# Altium project SDR_LAPAC.PrjPcb (part 3 of 4)

## Sheet Power.SchDoc
size D; DocumentNumber: 2; SheetNumber: 2
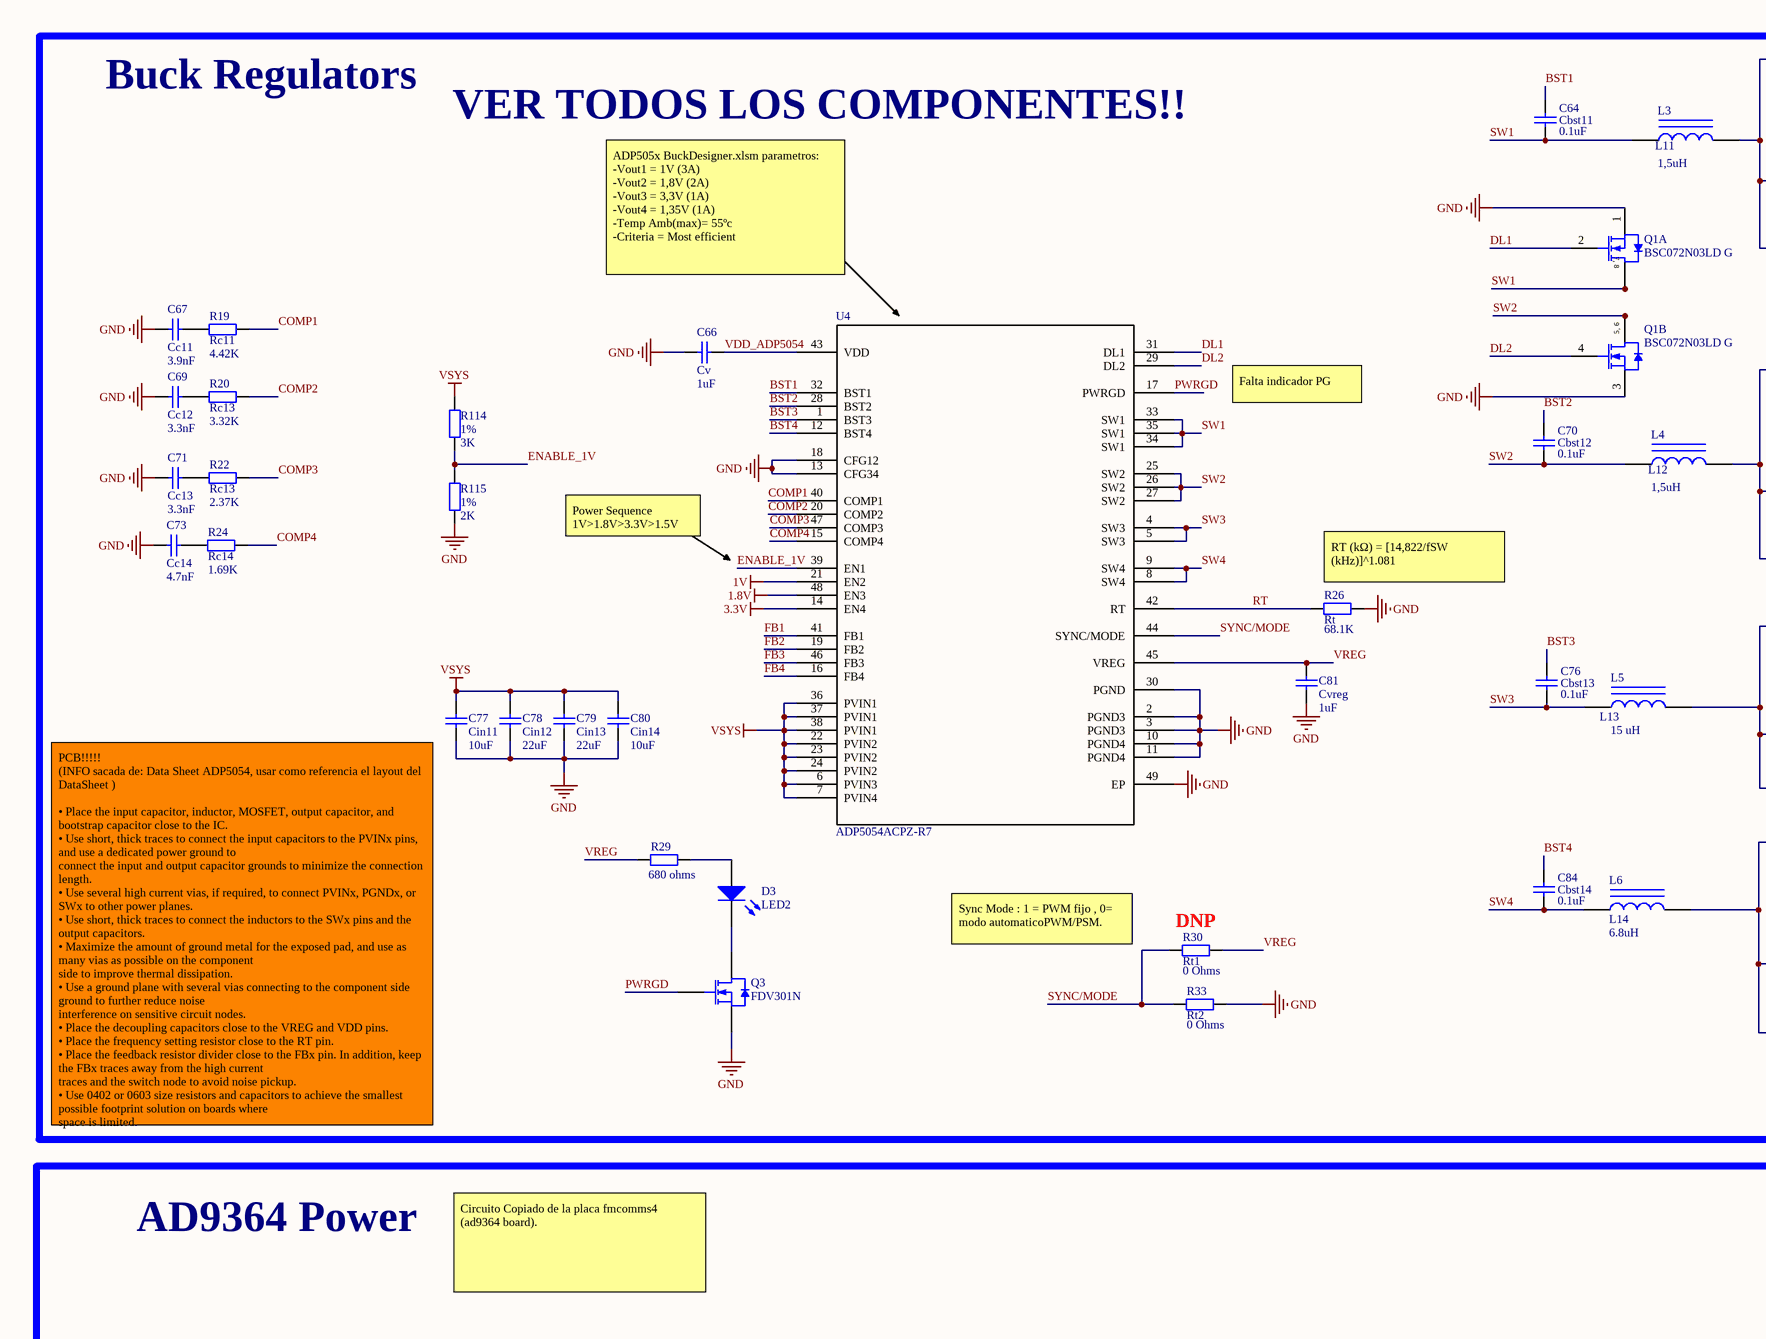
[diagram p14: Power.SchDoc, top left]
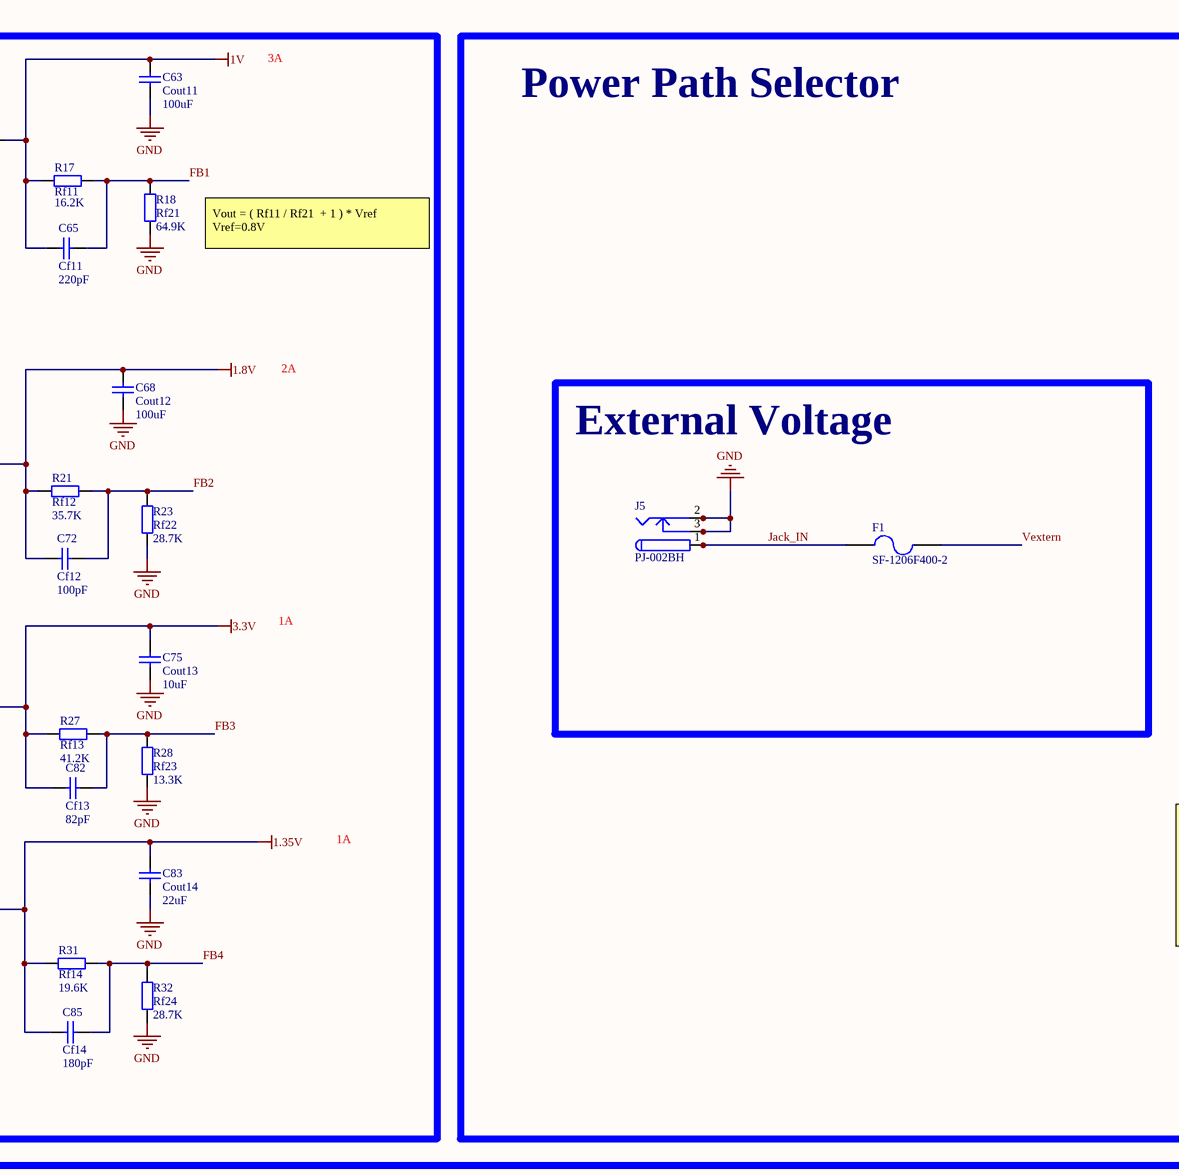
[diagram p15: Power.SchDoc, top middle]
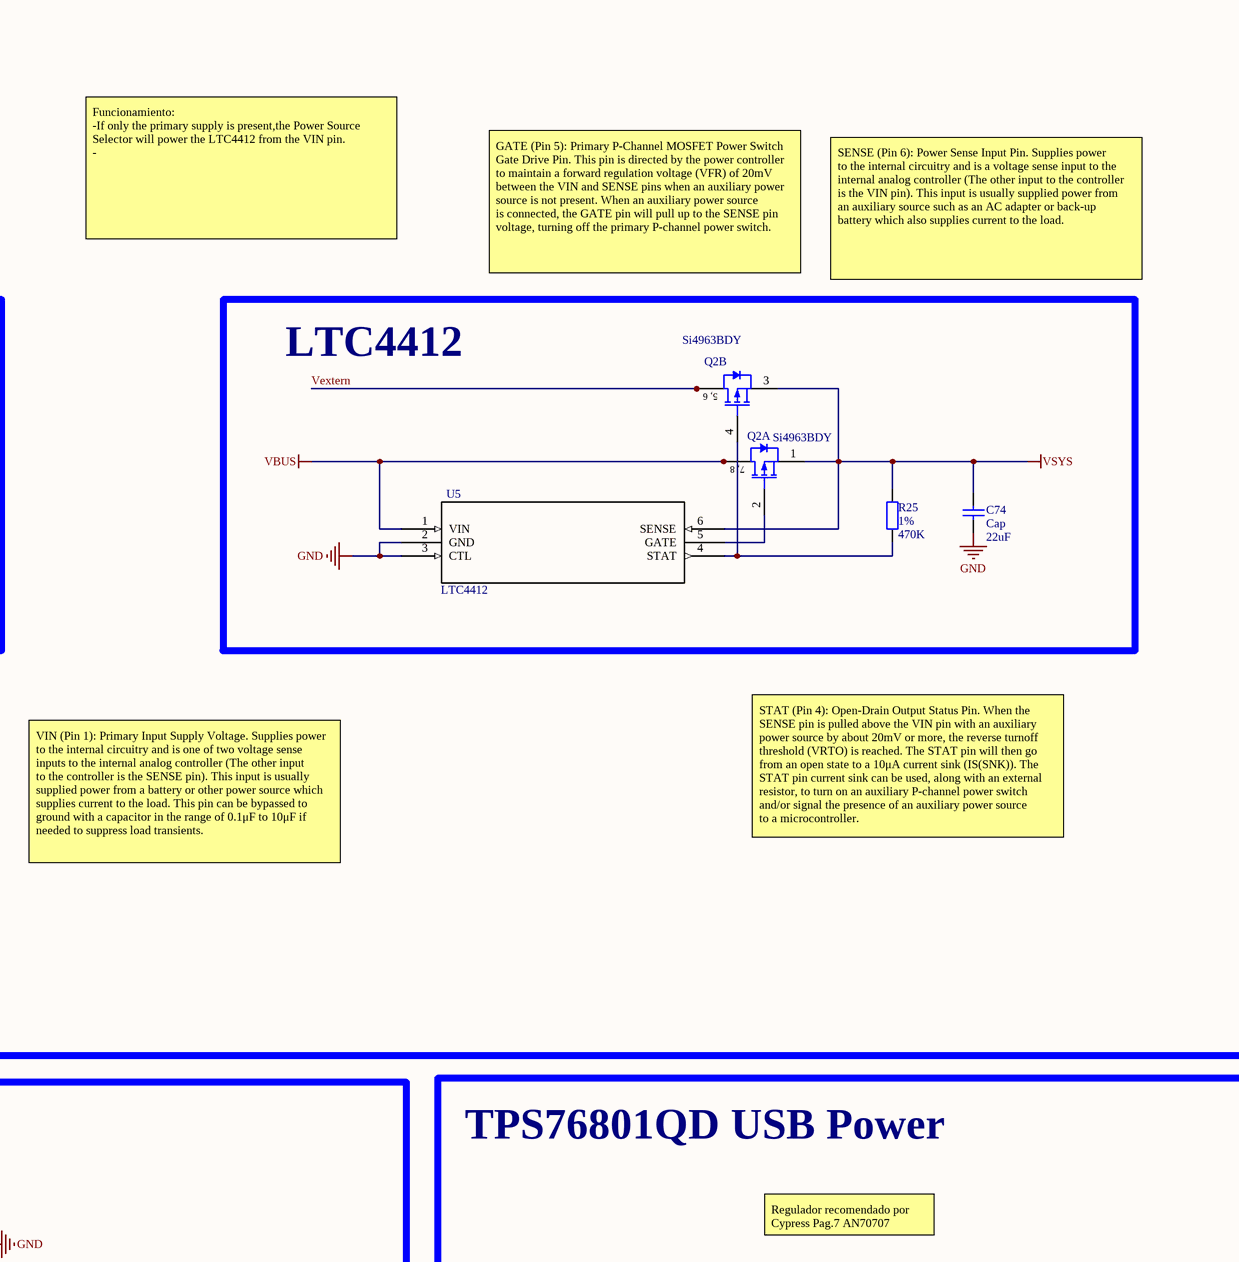
[diagram p16: Power.SchDoc, top right]
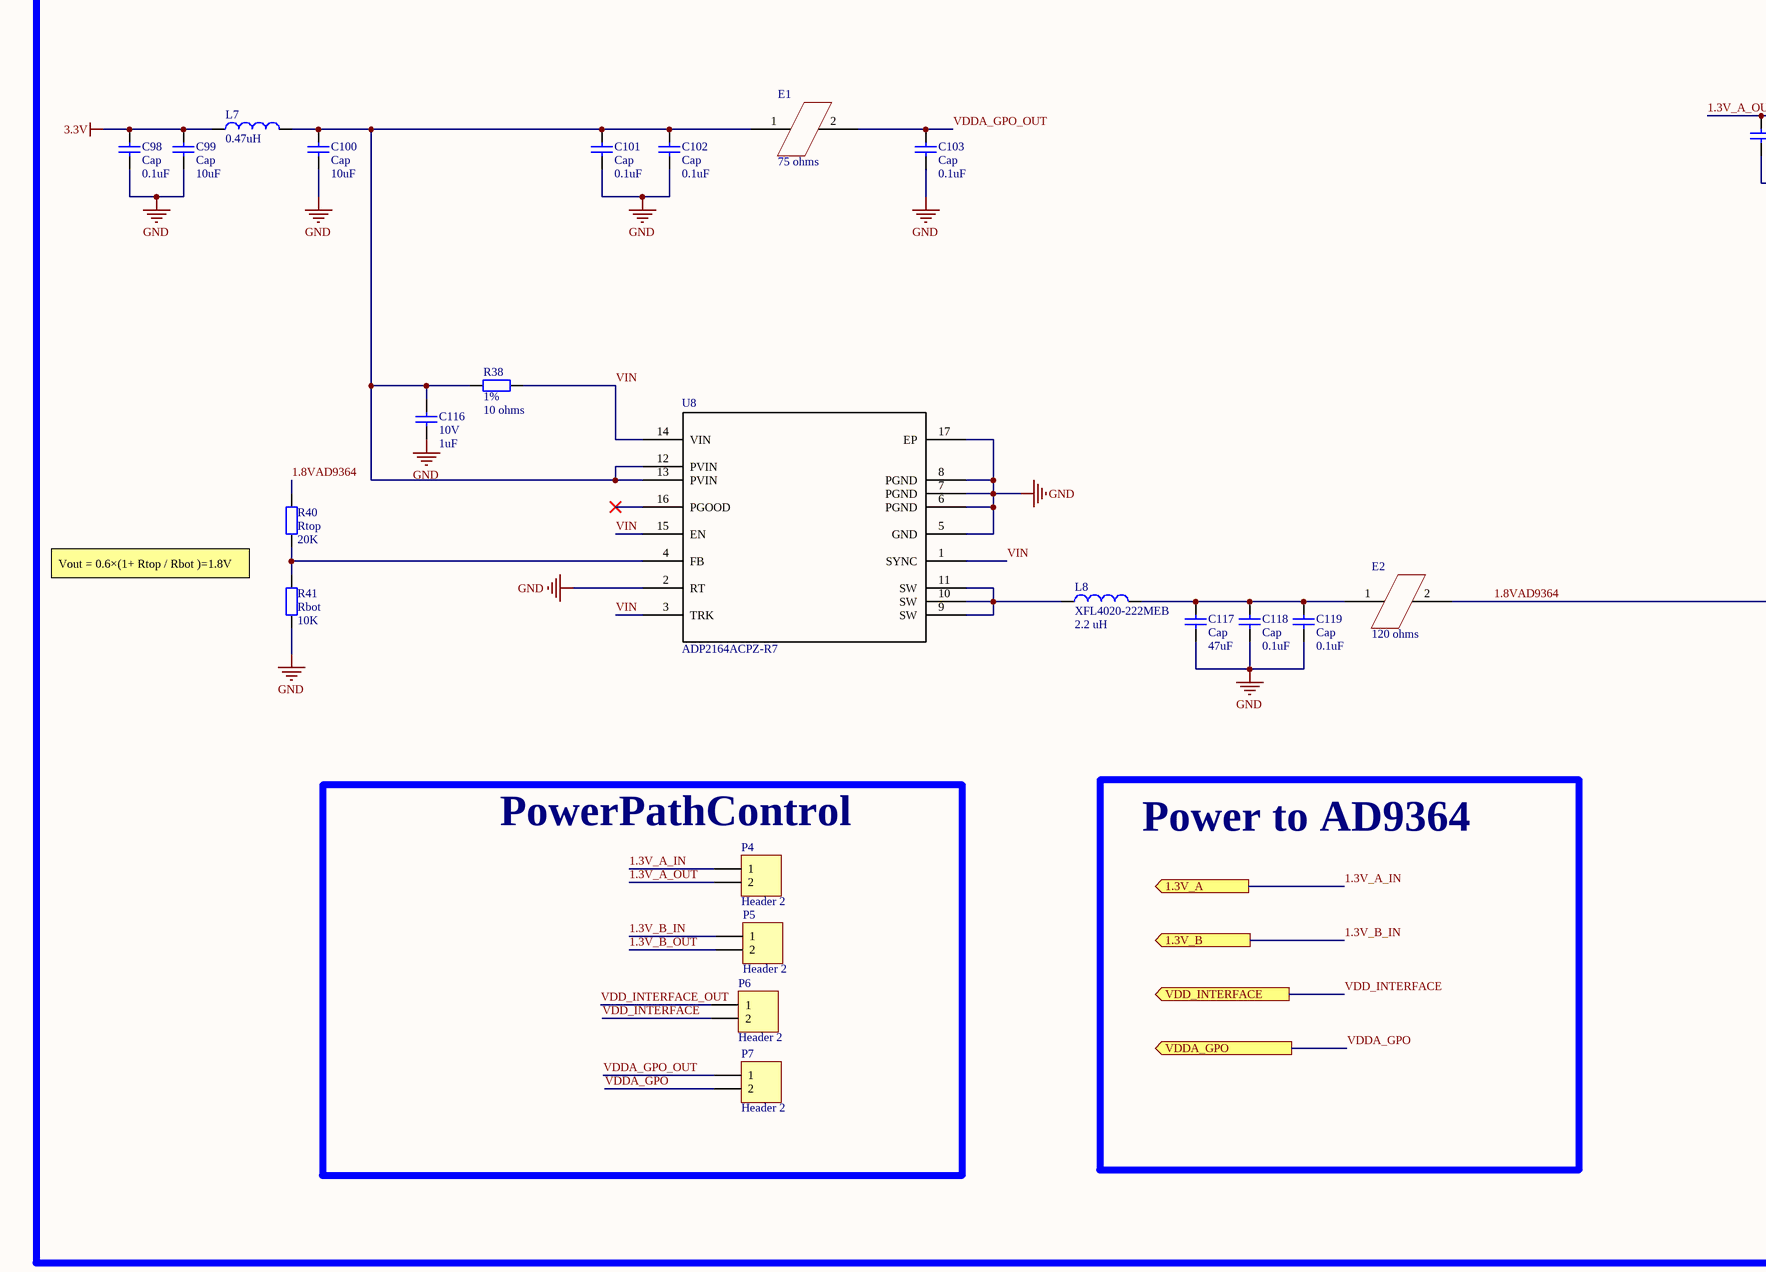
[diagram p17: Power.SchDoc, bottom left]
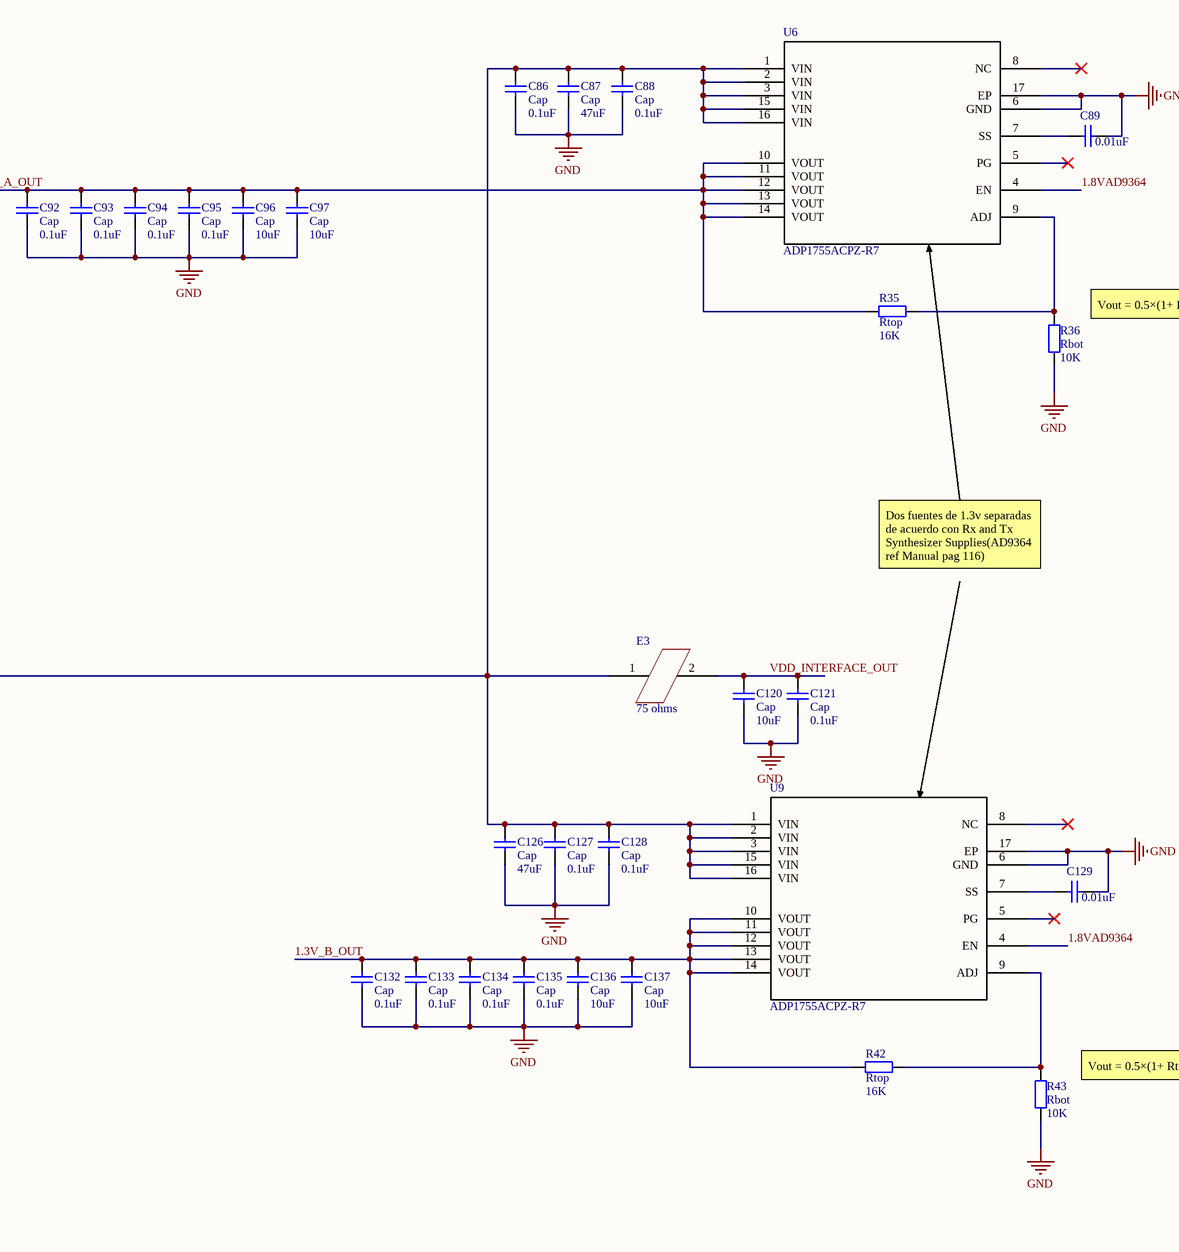
[diagram p18: Power.SchDoc, bottom middle]
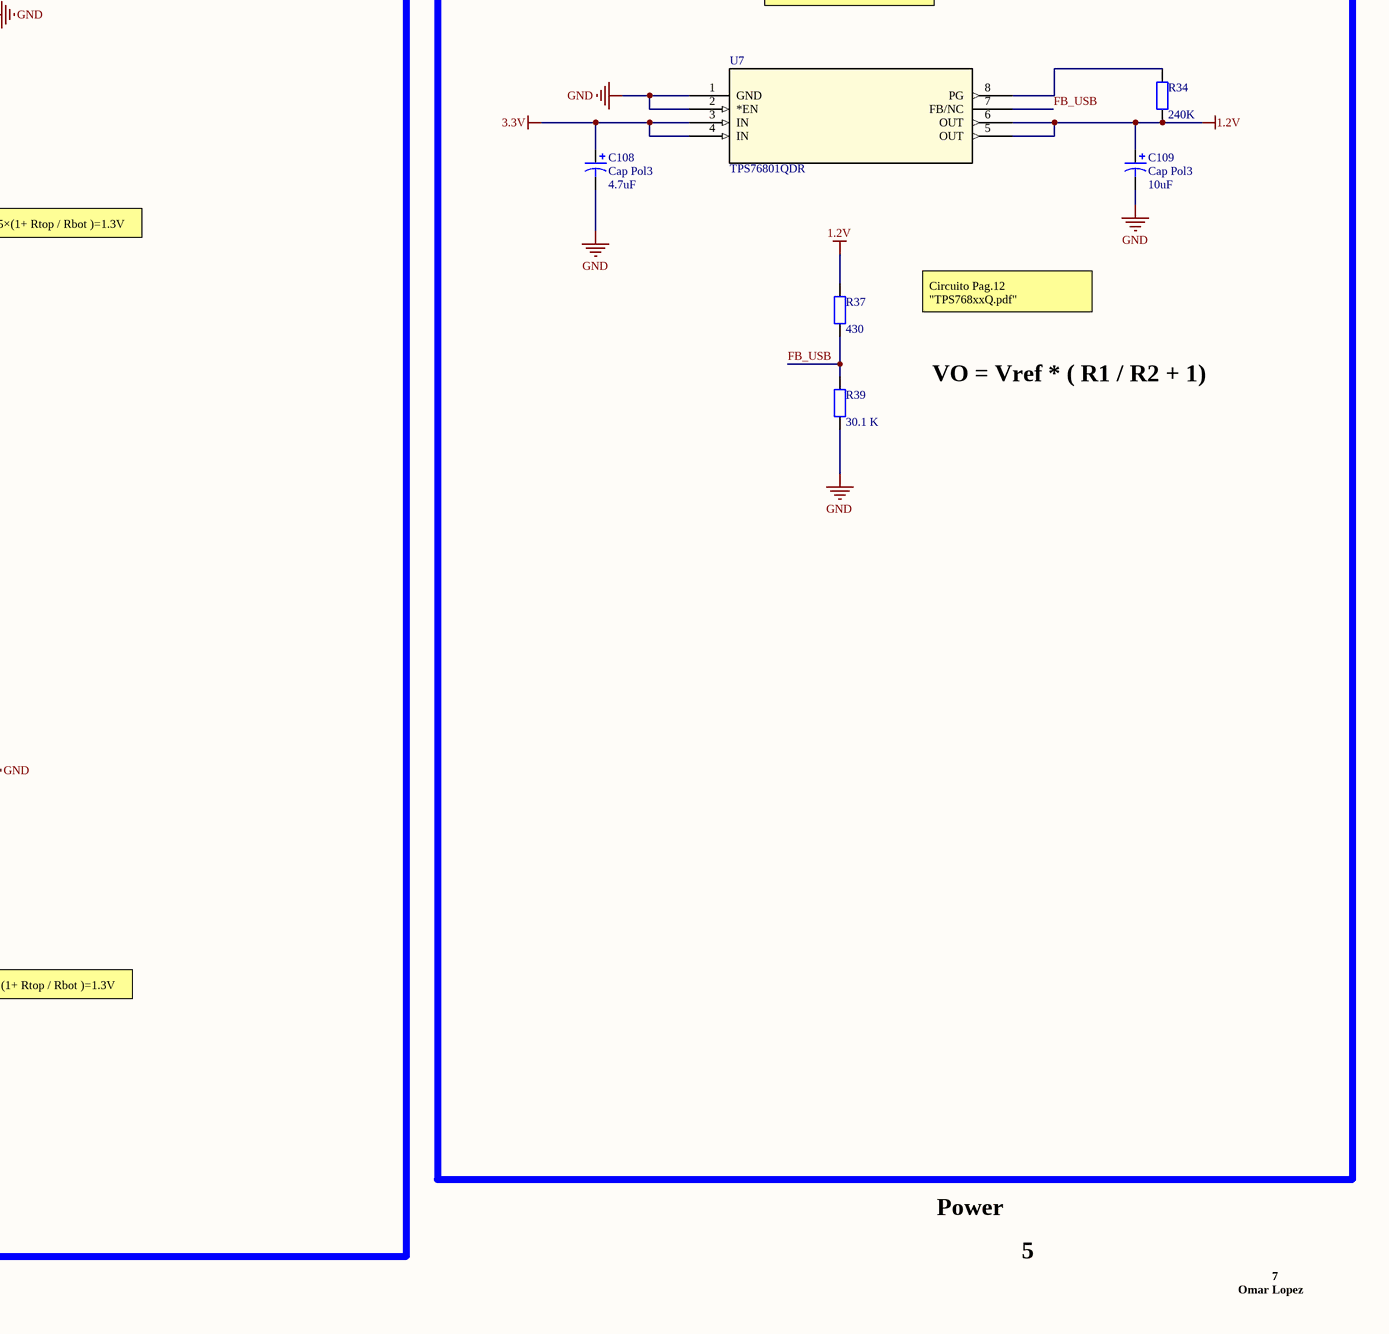
[diagram p19: Power.SchDoc, bottom right]

### Parts
C63  Cout11  value 100uF  [GRM1206MurataCap]
C64  Cbst11  value 0.1uF  [GRM0402MurataCap]
C65  Cf11  value 220pF  [GRM0402MurataCap]
C66  Cv  value 1uF  [GRM0402MurataCap]
C67  Cc11  value 3.9nF  [GRM0402MurataCap]
C68  Cout12  value 100uF  [GRM1206MurataCap]
C69  Cc12  value 3.3nF  [GRM0402MurataCap]
C70  Cbst12  value 0.1uF  [GRM0402MurataCap]
C71  Cc13  value 3.3nF  [GRM0402MurataCap]
C72  Cf12  value 100pF  [GRM0402MurataCap]
C73  Cc14  value 4.7nF  [GRM0402MurataCap]
C74  Cap  value 22uF  [GRM1210MurataCap]
C75  Cout13  value 10uF  [GRM1206MurataCap]
C76  Cbst13  value 0.1uF  [GRM0402MurataCap]
C77  Cin11  value 10uF  [GRM1210MurataCap]
C78  Cin12  value 22uF  [GRM1210MurataCap]
C79  Cin13  value 22uF  [GRM1210MurataCap]
C80  Cin14  value 10uF  [GRM1210MurataCap]
C81  Cvreg  value 1uF  [GRM0402MurataCap]
C82  Cf13  value 82pF  [GRM0402MurataCap]
C83  Cout14  value 22uF  [GRM1206MurataCap]
C84  Cbst14  value 0.1uF  [GRM0402MurataCap]
C85  Cf14  value 180pF  [GRM0402MurataCap]
C86  Cap  value 0.1uF  [GRM0402MurataCap]
C87  Cap  value 47uF  [GRM0805MurataCap]
C88  Cap  value 0.1uF  [GRM0402MurataCap]
C89  value 0.01uF  [GRM0402MurataCap]  (hidden comment: Cap)
C92  Cap  value 0.1uF  [GRM0402MurataCap]
C93  Cap  value 0.1uF  [GRM0402MurataCap]
C94  Cap  value 0.1uF  [GRM0402MurataCap]
C95  Cap  value 0.1uF  [GRM0402MurataCap]
C96  Cap  value 10uF  [GRM0603MurataCap]
C97  Cap  value 10uF  [GRM0603MurataCap]
C98  Cap  value 0.1uF  [GRM0402MurataCap]
C99  Cap  value 10uF  [GRM0603MurataCap]
C100  Cap  value 10uF  [GRM0603MurataCap]
C101  Cap  value 0.1uF  [GRM0402MurataCap]
C102  Cap  value 0.1uF  [GRM0402MurataCap]
C103  Cap  value 0.1uF  [GRM0402MurataCap]
C108  Cap Pol3  value 4.7uF  [CapTalCaseM]
C109  Cap Pol3  value 10uF  [TAJ_DorE2917]
C116  10V  value 1uF  [GRM0402MurataCap]
C117  Cap  value 47uF  [GRM0805MurataCap]
C118  Cap  value 0.1uF  [GRM0402MurataCap]
C119  Cap  value 0.1uF  [GRM0402MurataCap]
C120  Cap  value 10uF  [GRM0603MurataCap]
C121  Cap  value 0.1uF  [GRM0402MurataCap]
C126  Cap  value 47uF  [GRM0805MurataCap]
C127  Cap  value 0.1uF  [GRM0402MurataCap]
C128  Cap  value 0.1uF  [GRM0402MurataCap]
C129  value 0.01uF  [GRM0402MurataCap]  (hidden comment: Cap)
C132  Cap  value 0.1uF  [GRM0402MurataCap]
C133  Cap  value 0.1uF  [GRM0402MurataCap]
C134  Cap  value 0.1uF  [GRM0402MurataCap]
C135  Cap  value 0.1uF  [GRM0402MurataCap]
C136  Cap  value 10uF  [GRM0603MurataCap]
C137  Cap  value 10uF  [GRM0603MurataCap]
D3  LED2  [LTSTC191]
E1  75 ohms  [BLM15BA750SN1D]
E2  120 ohms  [BLM15BA750SN1D]
E3  75 ohms  [BLM15BA750SN1D]
F1  SF-1206F400-2  [SF-1206F400-2]
J5  PJ-002BH  [PJ-002BH]
L3  L11  value 1,5uH  [XAL4040-152]
L4  L12  value 1,5uH  [XAL4040-152]
L5  L13  value 15 uH  [XAL5050-153]
L6  L14  value 6.8uH  [XAL8080-682]
L7  0.47uH  [LQH32PNR47NN0L]
L8  XFL4020-222MEB  value 2.2 uH  [XFL4020 SERIES]
P4  Header 2  [Header2x1]
P5  Header 2  [Header2x1]
P6  Header 2  [Header2x1]
P7  Header 2  [Header2x1]
Q1  BSC072N03LD G  [INF-PG-TDSON-8-4_V]  (parts A,B of 2)
Q2  Si4963BDY  [SO-8_N]  (parts A,B of 2)
Q3  FDV301N  [SOT-23B]
R17  Rf11  value 16.2K  [RC0402N]
R18  Rf21  value 64.9K  [RC0402N]
R19  Rc11  value 4.42K  [RC0402N]
R20  Rc13  value 3.32K  [RC0402N]
R21  Rf12  value 35.7K  [RC0402N]
R22  Rc13  value 2.37K  [RC0402N]
R23  Rf22  value 28.7K  [RC0402N]
R24  Rc14  value 1.69K  [RC0402N]
R25  1%  value 470K  [RC0402N]
R26  Rt  value 68.1K  [RC0402N]
R27  Rf13  value 41.2K  [RC0402N]
R28  Rf23  value 13.3K  [RC0402N]
R29  value 680 ohms  [RC0402N]
R30  Rt1  value 0 Ohms  [RC0402N]
R31  Rf14  value 19.6K  [RC0402N]
R32  Rf24  value 28.7K  [RC0402N]
R33  Rt2  value 0 Ohms  [RC0402N]
R34  value 240K  [RC0402N]
R35  Rtop  value 16K  [RC0402N]
R36  Rbot  value 10K  [RC0402N]
R37  value 430  [RC0402N]
R38  1%  value 10 ohms  [RC0402N]
R39  value 30.1 K  [RC0402N]
R40  Rtop  value 20K  [RC0402N]
R41  Rbot  value 10K  [RC0402N]
R42  Rtop  value 16K  [RC0402N]
R43  Rbot  value 10K  [RC0402N]
R114  1%  value 3K  [RC0402N]
R115  1%  value 2K  [RC0402N]
U4  ADP5054ACPZ-R7  [CP_48_13]
U5  LTC4412  [TSOT-23_S6]
U6  ADP1755ACPZ-R7  [CP_16_4]
U7  TPS76801QDR  [D8]
U8  ADP2164ACPZ-R7  [CP_16_26]
U9  ADP1755ACPZ-R7  [CP_16_4]

### Blocks framed on the sheet
External Voltage: F1 J5
LTC4412: C74 Q2 R25 U5
TPS76801QD USB Power: C108 C109 R34 R37 R39 U7
PowerPathControl: P4-P7

### Ports
1.3V_A (out), 1.3V_B (out), VDD_INTERFACE (out), VDDA_GPO (out)

### Nets
1.2V: C109.1 R34.1 R37.2 U7.5(OUT) U7.6(OUT)
1.8V: C68.2 C72.2 L4.2 R21.2 U4.48(EN3)
1.35V: C83.2 C85.2 L6.2 R31.2
1V: C63.2 C65.2 L3.2 R17.2 U4.21(EN2)
3.3V: C75.2 C82.2 C98.2 C99.2 C108.1 L5.2 L7.1 R27.2 U4.14(EN4) U7.3(IN) U7.4(IN)
GND: C63.1 C66.1 C67.2 C68.1 C69.2 C71.2 C73.2 C74.1 C75.1 C77.1 C78.1 C79.1 C80.1 C81.2 C83.1 C86.1 C87.1 C88.1 C89.2 C92.1 C93.1 C94.1 C95.1 C96.1 C97.1 C98.1 C99.1 C100.1 C101.1 C102.1 C103.1 C108.2 C109.2 C116.2 C117.1 C118.1 C119.1 C120.1 C121.1 C126.1 C127.1 C128.1 C129.2 C132.1 C133.1 C134.1 C135.1 C136.1 C137.1 J5.2 J5.2A J5.2B J5.3 J5.3A J5.3B Q1.1(S1) Q1.3(S2) Q3.3(S) R18.1 R23.1 R26.2 R28.1 R32.1 R33.2 R36.2 R39.1 R41.2 R43.2 R115.1 U4.2(PGND3) U4.3(PGND3) U4.10(PGND4) U4.11(PGND4) U4.13(CFG34) U4.18(CFG12) U4.30(PGND) U4.49(EP) U5.2(GND) U5.3(CTL) U6.6(GND) U6.17(EP) U7.1(GND) U7.2(*EN) U8.2(RT) U8.5(GND) U8.6(PGND) U8.7(PGND) U8.8(PGND) U8.17(EP) U9.6(GND) U9.17(EP)
VBUS: Q2.7(D) Q2.8(D) U5.1(VIN)
VSYS: C74.2 C77.2 C78.2 C79.2 C80.2 Q2.1(S) Q2.3(S) R25.2 R114.2 U4.6(PVIN3) U4.7(PVIN4) U4.22(PVIN2) U4.23(PVIN2) U4.24(PVIN2) U4.36(PVIN1) U4.37(PVIN1) U4.38(PVIN1) U5.6(SENSE)
1.3V_A_IN: P4.1 ; port 1.3V_A  [project net 1.3V_A]
1.3V_A_OUT: C92.2 C93.2 C94.2 C95.2 C96.2 C97.2 P4.2 R35.2 U6.10(VOUT) U6.11(VOUT) U6.12(VOUT) U6.13(VOUT) U6.14(VOUT)
1.3V_B_IN: P5.1 ; port 1.3V_B  [project net 1.3V_B]
1.3V_B_OUT: C132.2 C133.2 C134.2 C135.2 C136.2 C137.2 P5.2 R42.2 U9.10(VOUT) U9.11(VOUT) U9.12(VOUT) U9.13(VOUT) U9.14(VOUT)
1.8VAD9364: C86.2 C87.2 C88.2 C126.2 C127.2 C128.2 E2.2 E3.1 R40.1 U6.1(VIN) U6.2(VIN) U6.3(VIN) U6.4(EN) U6.15(VIN) U6.16(VIN) U9.1(VIN) U9.2(VIN) U9.3(VIN) U9.4(EN) U9.15(VIN) U9.16(VIN)
BST1: C64.1 U4.32(BST1)
BST2: C70.1 U4.28(BST2)
BST3: C76.1 U4.1(BST3)
BST4: C84.1 U4.12(BST4)
COMP1: R19.2 U4.40(COMP1)
COMP2: R20.2 U4.20(COMP2)
COMP3: R22.2 U4.47(COMP3)
COMP4: R24.2 U4.15(COMP4)
DL1: Q1.2(G1) U4.31(DL1)
DL2: Q1.4(G2) U4.29(DL2)
ENABLE_1V: R114.1 R115.2 U4.39(EN1)
FB1: C65.1 R17.1 R18.2 U4.41(FB1)
FB2: C72.1 R21.1 R23.2 U4.19(FB2)
FB3: C82.1 R27.1 R28.2 U4.46(FB3)
FB4: C85.1 R31.1 R32.2 U4.16(FB4)
FB_USB: R37.1 R39.2 U7.7(FB/NC)
Jack_IN: F1.1 J5.1 J5.1A J5.1B
PWRGD: Q3.1(G) U4.17(PWRGD)
RT: R26.1 U4.42(RT)
SW1: C64.2 L3.1 Q1.7(D1) Q1.8(D1) U4.33(SW1) U4.34(SW1) U4.35(SW1)
SW2: C70.2 L4.1 Q1.5(D2) Q1.6(D2) U4.25(SW2) U4.26(SW2) U4.27(SW2)
SW3: C76.2 L5.1 U4.4(SW3) U4.5(SW3)
SW4: C84.2 L6.1 U4.8(SW4) U4.9(SW4)
SYNC/MODE: R30.1 R33.1 U4.44(SYNC/MODE)
VDD_ADP5054: C66.2 U4.43(VDD)
VDD_INTERFACE: P6.2 ; port VDD_INTERFACE
VDD_INTERFACE_OUT: C120.2 C121.2 E3.2 P6.1
VDDA_GPO: P7.2 ; port VDDA_GPO
VDDA_GPO_OUT: C103.2 E1.2 P7.1
Vextern: F1.2 Q2.5(D) Q2.6(D)
VIN: R38.2 U8.1(SYNC) U8.3(TRK) U8.14(VIN) U8.15(EN)
VREG: C81.1 R29.2 R30.2 U4.45(VREG)
NetC67_1: C67.1 R19.1
NetC69_1: C69.1 R20.1
NetC71_1: C71.1 R22.1
NetC73_1: C73.1 R24.1
NetC89_1: C89.1 U6.7(SS)
NetC100_2: C100.2 C101.2 C102.2 C116.1 E1.1 L7.2 R38.1 U8.12(PVIN) U8.13(PVIN)
NetC117_2: C117.2 C118.2 C119.2 E2.1 L8.2
NetC129_1: C129.1 U9.7(SS)
NetD3_1: D3.1(A) R29.1
NetD3_2: D3.2(K) Q3.2(D)
NetL8_1: L8.1 U8.9(SW) U8.10(SW) U8.11(SW)
NetQ2_2: Q2.2(G) U5.5(GATE)
NetQ2_4: Q2.4(G) R25.1 U5.4(STAT)
NetR34_2: R34.2 U7.8(PG)
NetR35_1: R35.1 R36.1 U6.9(ADJ)
NetR40_2: R40.2 R41.1 U8.4(FB)
NetR42_1: R42.1 R43.1 U9.9(ADJ)

Not connected (* = marked no-connect by the designer): U6 5(PG)* 8(NC)*; U8 16(PGOOD)*; U9 5(PG)* 8(NC)*

### Notes on the sheet
- Buck Regulators
- 3A
- Power Path Selector
- VER TODOS LOS COMPONENTES!!
- Vout = ( Rf11 / Rf21  + 1 ) * Vref
  Vref=0.8V
- ADP505x BuckDesigner.xlsm parametros:
  -Vout1 = 1V (3A)
  -Vout2 = 1,8V (2A)
  -Vout3 = 3,3V (1A)
  -Vout4 = 1,35V (1A)
  -Temp Amb(max)= 55ºc
  -Criteria = Most efficient
- 2A
- Funcionamiento:
  -If only the primary supply is present,the Power Source Selector will power the LTC4412 from the VIN pin.
  -
- GATE (Pin 5): Primary P-Channel MOSFET Power Switch
  Gate Drive Pin. This pin is directed by the power controller
  to maintain a forward regulation voltage (VFR) of 20mV
  between the VIN and SENSE pins when an auxiliary power
  source is not present. When an auxiliary power source
  is connected, the GATE pin will pull up to the SENSE pin
  voltage, turning off the primary P-channel power switch.
- SENSE (Pin 6): Power Sense Input Pin. Supplies power
  to the internal circuitry and is a voltage sense input to the
  internal analog controller (The other input to the controller
  is the VIN pin). This input is usually supplied power from
  an auxiliary source such as an AC adapter or back-up
  battery which also supplies current to the load.
- Falta indicador PG
- Power Sequence 1V>1.8V>3.3V>1.5V
- (near R26) RT (kΩ) = [14,822/fSW (kHz)]^1.081
- 1A
- STAT (Pin 4): Open-Drain Output Status Pin. When the
  SENSE pin is pulled above the VIN pin with an auxiliary
  power source by about 20mV or more, the reverse turnoff
  threshold (VRTO) is reached. The STAT pin will then go
  from an open state to a 10μA current sink (IS(SNK)). The
  STAT pin current sink can be used, along with an external
  resistor, to turn on an auxiliary P-channel power switch
  and/or signal the presence of an auxiliary power source
  to a microcontroller.
- (near R30) Sync Mode : 1 = PWM fijo , 0= modo automaticoPWM/PSM.
- (near R30) DNP
- VIN (Pin 1): Primary Input Supply Voltage. Supplies power
  to the internal circuitry and is one of two voltage sense
  inputs to the internal analog controller (The other input
  to the controller is the SENSE pin). This input is usually
  supplied power from a battery or other power source which
  supplies current to the load. This pin can be bypassed to
  ground with a capacitor in the range of 0.1μF to 10μF if
  needed to suppress load transients.
- (near C77) PCB!!!!!
  (INFO sacada de: Data Sheet ADP5054, usar como referencia el layout del DataSheet )
  • Place the input capacitor, inductor, MOSFET, output capacitor, and bootstrap capacitor close to the IC.
  • Use short, thick traces to connect the input capacitors to the PVINx pins, and use a dedicated power ground to
  connect the input and output capacitor grounds to minimize the connection length.
  • Use several high current vias, if required, to connect PVINx, PGNDx, or SWx to other power planes.
  • Use short, thick traces to connect the inductors to the SWx pins and the output capacitors.
  • Maximize the amount of ground metal for the exposed pad, and use as many vias as possible on the component
  side to improve thermal dissipation.
  • Use a ground plane with several vias connecting to the component side ground to further reduce noise
  interference on sensitive circuit nodes.
  • Place the decoupling capacitors close to the VREG and VDD pins.
  • Place the frequency setting resistor close to the RT pin.
  • Place the feedback resistor divider close to the FBx pin. In addition, keep the FBx traces away from the high current
  traces and the switch node to avoid noise pickup.
  • Use 0402 or 0603 size resistors and capacitors to achieve the smallest possible footprint solution on boards where
  space is limited.
- AD9364 Power
- Circuito Copiado de la placa fmcomms4 (ad9364 board).
- Regulador recomendado por Cypress Pag.7 AN70707 "Hardware Design Guidelines and Schematic Checklist"
- (near R36) Vout = 0.5×(1+ Rtop / Rbot )=1.3V
- Circuito Pag.12 "TPS768xxQ.pdf"
- VO = Vref * ( R1 / R2 + 1)
- Dos fuentes de 1.3v separadas de acuerdo con Rx and Tx Synthesizer Supplies(AD9364 ref Manual pag 116)
- Vout = 0.6×(1+ Rtop / Rbot )=1.8V
- Power to AD9364
- (near R43) Vout = 0.5×(1+ Rtop / Rbot )=1.3V
- Power
- 5
- Omar Lopez
- 7
- (in symbol BSC072N03LD G, part A) 7, 8
- (in symbol BSC072N03LD G, part B) 5, 6
- (in symbol SI4925DY, part A) 7, 8
- (in symbol SI4925DY, part B) 5, 6

### Library data of the parts
C63 C68 = Cap: Capacitor; Manufacturer: TDK; PartNumber: C3225X5R0J107M250AC; Tolerance: 20%; Descripción: CAP CER 100UF 6.3V X5R 1210; CostoVendedor1: 1.5; CostoVendedor2: 1.25; Vendedor1: Mouser; Vendedor2: Digi-Key; Package: 1206; DataSheet: http://www.mouser.com/ds/2/281/c02e-2905.pdf; LinkVendedor1: https://ar.mouser.com/ProductDetail/TDK/C3225X5R0J107M250AC?qs=%2fha2pyFadugsKC97ZN9bGAHl0PMw9sBKIbnYm4NbglCBu7hNaip2kw%3d%3d; LinkVendedor2: https://www.digikey.com/product-detail/en/tdk-corporation/C3225X5R0J107M250AC/445-1437-1-ND/569103; Stock1: 422; Stock2: 185
C64 C70 C76 C84 = Cap: Capacitor; Manufacturer: Murata; PartNumber: GRM152D70G104ME15D; Descripción: CAP CER 0.1UF 6.3V X6S 0402; Tolerance: 10%; CostoVendedor1: 0.125; CostoVendedor2: 0.2; Vendedor1: Mouser; Vendedor2: Digi-Key; DataSheet: http://www.mouser.com/ds/2/281/c02e-2905.pdf; Package: 0402; LinkVendedor1: https://ar.mouser.com/ProductDetail/Murata-Electronics/GRM152C80J104ME19D?qs=%2fha2pyFadujYxtMOKJb%252bG4KaC8v3hU%2fa667jg855F5IKGi0T5%2fOAAoZ7C20qYSvJ; LinkVendedor2: https://www.digikey.com/product-detail/en/murata-electronics-north-america/GRM152C80J104ME19D/490-9998-1-ND/5026323; Stock1: 17400; Stock2: 15000
C65 = Cap: Capacitor; Manufacturer: Murata; PartNumber: GRM155R71H221KA01J; Tolerance: 5%; Descripción: Capacitores cerámicos de capas múltiples (MLCC) - SMD/SMT 220pF 50Volts X7R 10%; CostoVendedor1: 0.1; Vendedor1: Mouser; Vendedor2: Digi-Key; Package: 0402; DataSheet: http://www.mouser.com/ds/2/281/c02e-2905.pdf; CostoVendedor2: 0.1; LinkVendedor1: https://ar.mouser.com/ProductDetail/Murata-Electronics/GRM155R71H221KA01J?qs=sGAEpiMZZMs0AnBnWHyRQNchIam%2fLmo3TzcNvouk4rc%3d; LinkVendedor2: https://www.digikey.com/product-detail/en/murata-electronics-north-america/GRM155R71H221KA01J/490-11423-1-ND/5333263; Stock1: 46000; Stock2: 43000
C66 C81 C116 = Cap: Capacitor; Manufacturer: Murata; PartNumber: GRM155C81E105KE11D; Tolerance: 10%; Descripción: SMD/SMT 0402 1uF 6.3volts X5R 10%; CostoVendedor2: 0.3; Vendedor1: Mouser; Vendedor2: Digi-Key; Package: 0402; DataSheet: http://www.mouser.com/ds/2/281/c02e-2905.pdf; LinkVendedor2: https://www.digikey.com/product-detail/en/murata-electronics-north-america/GRM155C81E105KE11D/490-10014-1-ND/5026352; Stock2: 4000
C67 = Cap: Capacitor; Manufacturer: Murata; PartNumber: GRM1557U1A392JA01D; Tolerance: 10%; CostoVendedor1: 0.028; Descripción: Capacitores cerámicos de capas múltiples (MLCC) - SMD/SMT 0.0039uF 50volts 10%; Vendedor1: Mouser; Vendedor2: Digi-Key; CostoVendedor2: 0.03000; Package: 0402; LinkVendedor1: https://ar.mouser.com/ProductDetail/Murata-Electronics/GRM1557U1A392JA01D?qs=%2fha2pyFaduj3hs2IFlsq2Zj4wBBzXUAVydOAO%2f%252b9eRWOnvwMl6Yp0x484FViud0O; DataSheet: http://www.mouser.com/ds/2/281/c02e-2905.pdf; Stock1: 71,289; Stock2: 24,986; LinkVendedor2: https://www.digikey.com/product-detail/en/murata-electronics-north-america/GRM155R71H392KA01J/490-11425-1-ND/5333265
C69 C71 = Cap: Capacitor; Manufacturer: Murata; PartNumber: GRM15XR71C332KA86D; Tolerance: 10%; CostoVendedor1: 0.14; Descripción: Capacitores cerámicos de capas múltiples (MLCC) - SMD/SMT 0.0033uF 16VDC 10%; Vendedor1: Mouser; CostoVendedor2: 0.16; Vendedor2: Digi-Key; Package: 0402; LinkVendedor1: https://ar.mouser.com/ProductDetail/Murata-Electronics/GRM15XR71C332KA86D?qs=%2fha2pyFaduhgAC4ij%2fBPpNeVgGubla3O6p3JONwouYUrfyGF9%2fe%2f6hJlvx%252btrxYF; DataSheet: http://www.mouser.com/ds/2/281/c02e-2905.pdf; LinkVendedor2: https://www.digikey.com/product-detail/en/murata-electronics-north-america/GRM15XR71C332KA86D/490-8263-2-ND/2610974; Stock1: 9211; Stock2: 30000
C72 = Cap: Capacitor; Manufacturer: Murata; PartNumber: GRM1555C2A101GA01D; Tolerance: 2%; Descripción: SMD/SMT 0402 100pF 50volts C0G 2%; CostoVendedor1: 0.1; Vendedor1: Mouser; Vendedor2: Digi-Key; Package: 0402; DataSheet: http://www.mouser.com/ds/2/281/c02e-2905.pdf; LinkVendedor1: https://ar.mouser.com/ProductDetail/Murata-Electronics/GRM1555C2A101GA01D?qs=sGAEpiMZZMs0AnBnWHyRQFv7x1xn%252bYFdn7JtUx94Gd9G7TfVFKxbxA%3d%3d; Stock1: 5500
C73 = Cap: Capacitor; Manufacturer: Murata; PartNumber: GRM155R71E472KA01D; Tolerance: 10%; CostoVendedor1: 0.028; Descripción: Capacitores cerámicos de capas múltiples (MLCC) - SMD/SMT 0402 4700pF 25volts X7R 10%; Vendedor1: Mouser; CostoVendedor2: 0.1; Vendedor2: Digi-Key; Package: 0402; LinkVendedor1: https://ar.mouser.com/ProductDetail/Murata-Electronics/GRM155R71E472KA01D?qs=%2fha2pyFadujIGegxGvwRDvea766mb5GsC4SCEzVsAJl3%2fcBu8GfSWw%3d%3d; DataSheet: http://www.mouser.com/ds/2/281/c02e-2905.pdf; Stock1: 32000; Stock2: 30000; LinkVendedor2: https://www.digikey.com/product-detail/en/murata-electronics-north-america/GRM155R71E472KA01D/490-1309-2-ND/587233
C74 C78 C79 C83 = Cap: Capacitor; Manufacturer: Taiyo Yuden; PartNumber: EMK316BJ226ML-T; Tolerance: 20%; Descripción: Capacitores cerámicos de capas múltiples (MLCC) - SMD/SMT 22uF 16V X5R +/-20% 1206 Gen Purp; CostoVendedor1: 0.67; CostoVendedor2: 0.71; Requerimiento: 22uF, 16V, 4mΩ; Vendedor1: Mouser; Vendedor2: Digi-Key; Package: 1206; DataSheet: https://ar.mouser.com/datasheet/2/396/mlcc02_e-1307760.pdf; LinkVendedor1: https://ar.mouser.com/ProductDetail/Taiyo-Yuden/EMK316BJ226ML-T?qs=%2fha2pyFaduhIA0l07u39g5cXdd8vXpEy20u23e6N9O0%2f5gk48fQ1dw%3d%3d; LinkVendedor2: https://www.digikey.com/product-detail/en/taiyo-yuden/EMK316BJ226ML-T/587-1433-1-ND/1004064; Stock1: en pedido llega 19 de mayo; Stock2: 80000
C75 = Cap: Capacitor; Manufacturer: Taiyo Yuden; PartNumber: EMK316BJ106ML-T; Tolerance: 20%; Descripción: Capacitores cerámicos de capas múltiples (MLCC) - SMD/SMT 10uF 16V X5R +/-20% 1206 Gen Purp; CostoVendedor1: 0.32; CostoVendedor2: 0.34; Vendedor1: Mouser; Vendedor2: Digi-Key; Package: 1206; DataSheet: http://www.mouser.com/ds/2/281/c02e-2905.pdf; LinkVendedor1: https://ar.mouser.com/ProductDetail/Taiyo-Yuden/EMK316BJ106ML-T?qs=%2fha2pyFadugc0ioThuDM8l4TMg5ki5CrQ9D7tcvNlWE5hPOto5iiag%3d%3d; LinkVendedor2: https://www.digikey.com/product-detail/en/taiyo-yuden/EMK316BJ106ML-T/587-2253-1-ND/2025234; Stock1: 159; Stock2: 1300
C77 C80 = Cap: Capacitor; Manufacturer: Murata; PartNumber: GRM32DR71E106KA12K; Tolerance: 10%; Descripción: Capacitores cerámicos de capas múltiples (MLCC) - SMD/SMT 10uF 25Volts 10%; CostoVendedor1: 0.53; CostoVendedor2: 0.7; Vendedor1: Mouser; Vendedor2: Digi-Key; Package: 1210; DataSheet: http://www.mouser.com/ds/2/281/c02e-2905.pdf; LinkVendedor1: https://ar.mouser.com/ProductDetail/Murata-Electronics/GRM32DR71E106KA12K?qs=%2fha2pyFaduhUx4ePoF%2fuUT4B%252b%2fTYyNISG%2fsCaOqn7uG49X2PEfh5MA%3d%3d; LinkVendedor2: https://www.digikey.com/product-detail/en/murata-electronics-north-america/GRM32DR71E106KA12K/490-6532-1-ND/3845729; Stock1: 15000; Stock2: 400
C82 = Cap: Capacitor; Manufacturer: Murata; PartNumber: GRM1555C1H820FA01D; Tolerance: 10%; Descripción: SMD/SMT 0402 47pF 50volts C0G 1%; CostoVendedor1: 0.1; Vendedor1: Mouser; Vendedor2: Digi-Key; Package: 0402; DataSheet: http://www.mouser.com/ds/2/281/c02e-2905.pdf; CostoVendedor2: 0.1; LinkVendedor1: https://ar.mouser.com/ProductDetail/Murata-Electronics/GRM1555C1H820FA01D?qs=sGAEpiMZZMs0AnBnWHyRQO3lCa4gsPOhSmunBRZ5B9E%3d; LinkVendedor2: https://www.digikey.com/product-detail/en/murata-electronics-north-america/GRM1555C1H820FA01D/490-8228-2-ND/3694031; Stock1: 38000; Stock2: 20000
C85 = Cap: Capacitor; Manufacturer: Murata; PartNumber: GRM1555C1H181FA01D; Tolerance: 5%; Descripción: SMD/SMT 820pF 50Volts 5%; CostoVendedor1: 0.16; CostoVendedor2: 0.18; Vendedor1: Mouser; Vendedor2: Digi-Key; Package: 0402; DataSheet: http://www.mouser.com/ds/2/281/c02e-2905.pdf; LinkVendedor1: https://ar.mouser.com/ProductDetail/Murata-Electronics/GRM1555C1H181FA01D?qs=sGAEpiMZZMs0AnBnWHyRQHilyuJh3tLyTJApVvqmdVE%3d; LinkVendedor2: https://www.digikey.com/product-detail/en/murata-electronics-north-america/GRM1555C1H181FA01D/490-8187-1-ND/4380480; Stock1: 62000; Stock2: 150000
C86 C88 C92-C95 C98 C101-C103 C118 C119 C121 C127 C128 C132-C135 = Cap: Capacitor; Manufacturer: Murata; PartNumber: GRM155R71C104JA88J; Tolerance: 10%; Descripción: 16V  smd; CostoVendedor1: 0.038; Vendedor1: Mouser; Vendedor2: Digi-Key; Package: 0402; DataSheet: http://www.mouser.com/ds/2/281/c02e-2905.pdf; LinkVendedor1: https://ar.mouser.com/ProductDetail/Murata-Electronics/GRM155R71C104JA88J?qs=sGAEpiMZZMs0AnBnWHyRQFv7x1xn%252bYFdm0Vh6fxhMY51u8SdTXijCg%3d%3d; Stock1: 4800
C87 C117 C126 = Cap: Capacitor; Manufacturer: Murata; PartNumber: GRM219R60G476ME44D; Tolerance: 20%; Descripción: SMD/SMT 0805 47uF 6.3volts *Derate Voltage/Temp; CostoVendedor2: 0.59500; Vendedor1: Mouser; Vendedor2: Digi-Key; Package: 0805; DataSheet: http://www.mouser.com/ds/2/281/c02e-2905.pdf; LinkVendedor2: https://www.digikey.com/product-detail/en/murata-electronics-north-america/GRM219R60G476ME44D/490-9949-1-ND/5026412; Stock2: 54662
C89 C129 = Cap: Capacitor; Manufacturer: Murata; PartNumber: GCG155L81E103KA01D; Tolerance: 10%; Descripción: SMD/SMT 0402 0.01uF 25volts X7R 10%; CostoVendedor1: 0.19; Vendedor1: Mouser; Vendedor2: Digi-Key; Package: 0402; DataSheet: https://ar.mouser.com/datasheet/2/281/c03e-516224.pdf; LinkVendedor1: https://ar.mouser.com/ProductDetail/Murata-Electronics/GCG155L81E103KA01D?qs=sGAEpiMZZMs0AnBnWHyRQID2xuQsFd1G0H3MNkFLCyvrnbiUuoaHUg%3d%3d; Stock1: 8800
C96 C97 C99 C100 C120 C136 C137 = Cap: Capacitor; Manufacturer: Murata; PartNumber: GRM188R60J106ME47J; Tolerance: 20%; Descripción: SMD/SMT 6.3Vdc 10uF X5R 20%; CostoVendedor1: 0.28; Vendedor1: Mouser; Vendedor2: Digi-Key; Package: 0603; DataSheet: http://www.mouser.com/ds/2/281/product-794208.pdf; LinkVendedor1: https://ar.mouser.com/ProductDetail/Murata-Electronics/GRM188R60J106ME47J?qs=sGAEpiMZZMs0AnBnWHyRQDoASYHpL3ZIsd%2fdJsf50z8%3d; Stock1: 5000
C108 = Cap Pol3: Polarized Capacitor (Surface Mount); PartNumber: 298D475X0016M2T; Manufacturer: Vishay; Tolerance: 20%; Descripción: Capacitores de tantalio - SMD sólido 4.7uF 16volts 20%; CostoVendedor1: 1.81; Vendedor1: Mouser; Vendedor2: Digi-Key; Package: 0603; DataSheet: http://www.mouser.com/ds/2/427/298d298w-88350.pdf; LinkVendedor1: https://ar.mouser.com/ProductDetail/Vishay/298D475X0016M2T?qs=%2fha2pyFadugZ%252b6lfrjLT0K71GQBWvaSWelJF0%2fAnN3pz4x2s%2fPGDVg%3d%3d; Stock1: 3000
C109 = Cap Pol3: Polarized Capacitor (Surface Mount); PartNumber: TAJD106K035RNJ; Manufacturer: AVX; Tolerance: 30%; Descripción: Capacitores de tantalio - SMD sólido 35volts 10uF 10%; CostoVendedor1: 1.2; Vendedor1: Mouser; Vendedor2: Digi-Key; Package: 0805; DataSheet: http://www.mouser.com/ds/2/40/taj-776811.pdf; LinkVendedor1: https://ar.mouser.com/ProductDetail/AVX/TAJD106K035RNJ?utm_term=TAJD106K035RNJ&qs=srZBJ3srS4B1AM3VUvjCYQ%3d%3d&utm_campaign=TAJD106K035RNJ&utm_medium=aggregator&utm_source=findchips&utm_content=AVX; Stock1: 12000
D3 = LED2: Typical RED, GREEN, YELLOW, AMBER GaAs LED; Manufacturer: Panasonic; PartNumber: LTST-C193TGKT-5A; Descripción: LED estándar - SMD (montaje superficial) LED RED RECT; CostoVendedor1: 0.28; Vendedor1: Mouser; Vendedor2: Digi-Key; DataSheet: http://www.mouser.com/ds/2/315/LNJ247W82RA_E-947457.pdf; Package: 0603; LinkVendedor1: https://ar.mouser.com/ProductDetail/Lite-On/LTST-C193TGKT-5A?qs=sGAEpiMZZMseGfSY3csMkTQVMbQ3YFstHskAr8LAtWI%3d; Stock1: 29700
E1 E3 = Ferrite Bead: Manufacturer: Murata; Descripción: Núcleos de ferrita 75 Ohm 25%; Tolerance: 25%; CostoVendedor1: 0.11; Vendedor1: Mouser; Vendedor2: Digi-Key; PartNumber: BLM15BA750SN1D; DataSheet: http://www.murata.com/en-sg/products/productdata/8796740059166/ENFA0018.pdf?1492659014000; Package: 0402; LinkVendedor1: https://ar.mouser.com/ProductDetail/Murata-Electronics/BLM15BA750SN1D?qs=%2fha2pyFadugypmZvoBhUrnbAQirXWa5lakCap2sUy2P%252bLlFZb%252bhNLA%3d%3d; Stock1: 47000
E2 = Ferrite Bead: Manufacturer: Murata; PartNumber: BLM15EG121SN1D; Descripción: Núcleos de ferrita 120 OHM GHZ BAND; Tolerance: 25%; CostoVendedor1: 0.23; Vendedor1: Mouser; Vendedor2: Digi-Key; DataSheet: http://www.mouser.com/ds/2/281/c31e-794748.pdf; Package: 0402; Value: 120 ohms; LinkVendedor1: https://ar.mouser.com/ProductDetail/Murata-Electronics/BLM15EG121SN1D?qs=%2fha2pyFaduioWGQW5Gd6rhsp8tN9gM0oUkGcs7RsWnwqsSqJha0rlA%3d%3d; Stock1: 180000
F1 = Fuse 2: Fuse; Manufacturer: Bourns; Descripción: Fusibles de montaje en superficie 4A Fast Acting 1206 SinglFuse; CostoVendedor1: 0.64; CostoVendedor2: 0.7; Vendedor1: Mouser; Vendedor2: Digi-Key; DataSheet: https://ar.mouser.com/datasheet/2/54/f1206f-778027.pdf; Package: 1206; PartNumber: SF-1206F400-2; LinkVendedor1: https://ar.mouser.com/ProductDetail/Bourns/SF-1206F400-2?qs=%2fha2pyFaduiJTUzueKLhiMR0aUaVyxFPYo0Hu54FEa%2fcIJ4S4yMKPA%3d%3d; LinkVendedor2: https://www.digikey.com/product-detail/en/bourns-inc/SF-1206F400-2/SF-1206F400-2CT-ND/1948208; Stock1: 5000; Stock2: 1400
J5 = PWR2.5: Low Voltage Power Supply Connector; Manufacturer: CUI; Descripción: Conectores de corriente CD Power Jacks; CostoVendedor1: 0.74; Vendedor1: Mouser; Vendedor2: Digi-Key; DataSheet: http://www.mouser.com/ds/2/670/pj-002bh-528069.pdf; Package: PJ; PartNumber: PJ-002BH; CostoVendedor2: 0.74; LinkVendedor1: https://ar.mouser.com/ProductDetail/CUI/PJ-002BH?qs=sGAEpiMZZMtnOp%252bbbqA009lE0K0K%252bPZGI3zhVhcJhgMK7491%2f27uFQ%3d%3d; LinkVendedor2: https://www.digikey.com/product-detail/en/cui-inc/PJ-002BH/CP-002BH-ND/408447; Stock1: 3000; Stock2: 27000
L3 L4 = Inductor Iron: Magnetic-Core Inductor; Manufacturer: Coilcraft; PartNumber: XFL4020-152MEB; Tolerance: 20%; Descripción: Inductores fijos 1.5uH 20% 9.1A 15.8mOhms AEC-Q200; CostoVendedor1: 2; LinkVendedor2: No tiene; Vendedor1: Mouser; Vendedor2: Digi-Key; Package: XFL4020; DataSheet: https://ar.mouser.com/datasheet/2/597/xfl4020-270756.pdf; LinkVendedor1: https://ar.mouser.com/ProductDetail/Coilcraft/XFL4020-152MEB?qs=sGAEpiMZZMsg%252by3WlYCkU2kWFds1hA9DobNd8FV2BrA%3d; Stock1: 2600; Stock2: No tiene
L5 = Inductor Iron: Magnetic-Core Inductor; Manufacturer: Coilcraft; PartNumber: XAL5050-153MEB; Tolerance: 20%; Descripción: Inductores fijos 15uH 20% 3.9A 76.7mOhms AEC-Q200; CostoVendedor1: 2.57; Vendedor1: Mouser; Vendedor2: Digi-Key; Package: XAL5050; DataSheet: http://www.mouser.com/ds/2/597/mss7341t-270711.pdf; LinkVendedor1: https://ar.mouser.com/ProductDetail/Coilcraft/XAL5050-153MEB?qs=sGAEpiMZZMsg%252by3WlYCkU2kWFds1hA9De%252b4IHVE7pIg%3d; Stock1: 2230
L6 = Inductor Iron: Magnetic-Core Inductor; Manufacturer: Coilcraft; PartNumber: XAL8080-682MEB; Tolerance: 20%; Descripción: Inductores fijos XFL4020 AEC-Q200 4.7 uH 20 % 5 A; CostoVendedor1: 5.82; Vendedor1: Mouser; Vendedor2: Digi-Key; Package: XAL8080; DataSheet: http://www.mouser.com/ds/2/597/mlc-270743.pdf; LinkVendedor1: https://ar.mouser.com/ProductDetail/Coilcraft/XAL8080-682MEB?qs=sGAEpiMZZMsg%252by3WlYCkU2kWFds1hA9DVDzSXdWXN94%3d; Stock1: 420
L7 = Inductor: Manufacturer: Murata; Descripción: Inductores fijos 1210 0.47uH 30%; CostoVendedor1: 0.41; Vendedor1: Mouser; Vendedor2: Digi-Key; Value: 0.47uH; DataSheet: http://www.mouser.com/ds/2/281/o05e-522697.pdf; Package: 1210; PartNumber: LQH32PNR47NN0L; CostoVendedor2: 0.41; LinkVendedor1: https://ar.mouser.com/ProductDetail/Murata-Electronics/LQH32PNR47NN0L?qs=%2fha2pyFadujRpd%252bRVVtu4nCcPTsMM4hfcxBR586feYe8yJ%2fTk6taLQ%3d%3d; LinkVendedor2: https://www.digikey.com/product-detail/en/murata-electronics-north-america/LQH32PNR47NN0L/490-5333-1-ND/2092206; Stock1: 1600; Stock2: 6000
L8 = Inductor: Manufacturer: Coilcraft; Descripción: Inductores fijos XFL4020 Low DCR Ind 2.2 uH 20 % 8 A; Tolerance: 20%; CostoVendedor1: 1.99; Vendedor1: Mouser; Vendedor2: Digi-Key; DataSheet: http://www.mouser.com/ds/2/597/xfl4020-270756.pdf; Package: XFL4020; PartNumber: XFL4020-222MEB; LinkVendedor1: https://ar.mouser.com/ProductDetail/Coilcraft/XFL4020-222MEB?qs=sGAEpiMZZMsg%252by3WlYCkU2kWFds1hA9D32ulCUPTBYI%3d; Stock1: 11000
P4-P7 = Header 2: Header, 2-Pin; Manufacturer: TE Connectivity; PartNumber: 826629; Descripción: Header 2x1 step 2,54mm; CostoVendedor1: 0.18; Vendedor1: Mouser; Vendedor2: Digi-Key; DataSheet: https://ar.mouser.com/datasheet/2/418/NG_CD_826629_AC-673634.pdf; LinkVendedor1: https://ar.mouser.com/ProductDetail/TE-Connectivity-AMP/5-826629-0?qs=sGAEpiMZZMuSK2mCDyT9clxPLHEBGojU; Stock1: 3600
Q1 = BSC072N03LD G: N-Channel OptiMOS 3 Power-Transistors, 30 V VDS, 20 A ID, -55 to 150 degC, PG-TDSON-8-4, Reel, Green; Manufacturer: Infineon; Descripción: MOSFET N-Ch 30V 20A TDSON-8 OptiMOS 3; CostoVendedor1: 1.31; CostoVendedor2: 1.65; Vendedor1: Mouser; Vendedor2: Digi-Key; PartNumber: BSC072N03LD G; DataSheet: https://ar.mouser.com/datasheet/2/196/BSC072N03LD_rev1.4-1225291.pdf; LinkVendedor1: https://ar.mouser.com/ProductDetail/Infineon-Technologies/BSC072N03LD-G?qs=sGAEpiMZZMshyDBzk1%2fWi9Xn%2fBYY8cyRAJeqSQNLNhI%3d; LinkVendedor2: https://www.digikey.com/product-detail/en/infineon-technologies/BSC072N03LDGATMA1/BSC072N03LDGATMA1CT-ND/2231036; Stock1: 5900; Stock2: 10300
Q2 = SI4925DY: Dual P-Channel 30V (D-S)  MOSFET
Q3 = SUP70N06-14: N-Channel 60V (D-S), 175'C  MOSFET; Manufacturer: On Semiconductor; Descripción: MOSFET N-Ch Digital; CostoVendedor1: 0.23; CostoVendedor2: 0.28; Vendedor1: Mouser; Vendedor2: Digi-Key; DataSheet: http://www.mouser.com/ds/2/308/FDV301N-1123574.pdf; Package: SOT23; PartNumber: FDV301N; LinkVendedor1: https://ar.mouser.com/ProductDetail/ON-Semiconductor-Fairchild/FDV301N?qs=%2fha2pyFadujAYpqpxz9xOxyu2NXFF4PQT%2fJhMIZ7j6w%3d; LinkVendedor2: https://www.digikey.com/product-detail/en/on-semiconductor/FDV301N/FDV301NTR-ND/458851; Stock1: En pedido; Stock2: 72000
R17 = Res2: Resistor; Manufacturer: Panasonic; PartNumber: ERJ-2RKF1622X; Tolerance: 1%; Descripción: Resistores de película gruesa - SMD 0402 16.2Kohms 1% AEC-Q200; CostoVendedor1: 0.021; CostoVendedor2: 0.1; Vendedor1: Mouser; Vendedor2: Digi-Key; Package: 0402; DataSheet: http://www.mouser.com/ds/2/315/AOA0000C86-911473.pdf; LinkVendedor1: https://ar.mouser.com/ProductDetail/Panasonic-Industrial-Devices/ERJ-2RKF1622X?qs=%2fha2pyFadujciewGcSbxYKL2JABf7eg%252b%252bxwxcs8utpPlSfXR5ZQyfg%3d%3d; LinkVendedor2: https://www.digikey.com/product-detail/en/panasonic-electronic-components/ERJ-2RKF1622X/P16.2KLCT-ND/194198; Stock1: 17900; Stock2: 400000
R18 = Res2: Resistor; Manufacturer: Panasonic; PartNumber: ERJ-2RKF6492X; Tolerance: 1%; Descripción: Resistores de película gruesa - SMD 0402 64.9Kohms 1% AEC-Q200; CostoVendedor1: 0.021; CostoVendedor2: 0.043; Vendedor1: Mouser; Vendedor2: Digi-Key; Package: 0402; DataSheet: https://ar.mouser.com/ProductDetail/Panasonic-Industrial-Devices/ERJ-2RKF6492X?qs=%2fha2pyFadujciewGcSbxYL3R9jUsT7Mt6SfJZ7k6AVM89nbDkOxiLg%3d%3d; LinkVendedor1: https://ar.mouser.com/ProductDetail/Panasonic-Industrial-Devices/ERJ-2RKF6492X?qs=%2fha2pyFadujciewGcSbxYL3R9jUsT7Mt6SfJZ7k6AVM89nbDkOxiLg%3d%3d; LinkVendedor2: https://www.digikey.com/product-detail/en/panasonic-electronic-components/ERJ-2RKF6492X/P64.9KLCT-ND/194485; Stock1: 149000; Stock2: 400000
R19 = Res2: Resistor; Manufacturer: Panasonic; PartNumber: ERJ-2RKF4421X; Tolerance: 1%; CostoVendedor1: 0.021; Descripción: Resistores de película gruesa - SMD 0402 4.42Kohms 1% AEC-Q200; Vendedor1: Mouser; Vendedor2: Digi-Key; CostoVendedor2: 0.1; Package: 0402; LinkVendedor1: https://ar.mouser.com/ProductDetail/Panasonic-Industrial-Devices/ERJ-2RKF4421X?qs=sGAEpiMZZMu61qfTUdNhG6gKAQVNBKOoXwp87cJwVEc%3d; DataSheet: http://www.mouser.com/ds/2/315/AOA0000C86-911473.pdf; LinkVendedor2: https://www.digikey.com/product-detail/en/panasonic-electronic-components/ERJ-2RKF4421X/P4.42KLCT-ND/194384; Stock1: 218000; Stock2: 86000
R20 = Res2: Resistor; Manufacturer: Panasonic; PartNumber: ERJ-2RKF3321X; Tolerance: 1%; CostoVendedor1: 0.021; Descripción: 100mW 50V; Vendedor1: Mouser; CostoVendedor2: 0.1; Vendedor2: Digi-Key; Package: 0402; LinkVendedor1: https://ar.mouser.com/ProductDetail/Panasonic-Industrial-Devices/ERJ-2RKF3321X?qs=sGAEpiMZZMu61qfTUdNhG7cl%252bA5mpFfrdMgacAykP40%3d; DataSheet: https://ar.mouser.com/datasheet/2/315/AOA0000C304-1149620.pdf; Stock1: 43000; Stock2: 400000; LinkVendedor2: https://www.digikey.com/product-detail/en/panasonic-electronic-components/ERJ-2RKF3321X/P3.32KLTR-ND/192281
R21 = Res2: Resistor; Manufacturer: Panasonic; PartNumber: ERJ-2RKF3572X; Tolerance: 1%; Descripción: Resistores de película gruesa - SMD 0402 35.7Kohms 1% AEC-Q200; CostoVendedor1: 0.021; CostoVendedor2: 0.043; Vendedor1: Mouser; Vendedor2: Digi-Key; Package: 0402; DataSheet: https://ar.mouser.com/datasheet/2/315/AOA0000C304-1149620.pdf; LinkVendedor1: https://ar.mouser.com/ProductDetail/Panasonic-Industrial-Devices/ERJ-2RKF3572X?qs=%2fha2pyFadujciewGcSbxYGl64LvwVrzRfUhLesqhlJbkvDRVa77mNA%3d%3d; LinkVendedor2: https://www.digikey.com/product-detail/en/panasonic-electronic-components/ERJ-2RKF3572X/P35.7KLCT-ND/194360; Stock1: 41000; Stock2: 500000
R22 = Res2: Resistor; Manufacturer: Panasonic; PartNumber: ERJ-2RKF2371X; Tolerance: 1%; CostoVendedor2: 0.1; Descripción: SMD 0402 15.4Kohms 1% AEC-Q200; Vendedor1: Mouser; Vendedor2: Digi-Key; CostoVendedor1: 0.021; Package: 0402; LinkVendedor1: https://ar.mouser.com/ProductDetail/Panasonic-Industrial-Devices/ERJ-2RKF2371X?qs=sGAEpiMZZMu61qfTUdNhG6gKAQVNBKOoW%2fi7qDDxMCc%3d; DataSheet: http://www.mouser.com/ds/2/315/AOA0000C86-911473.pdf; LinkVendedor2: https://www.digikey.com/product-detail/en/panasonic-electronic-components/ERJ-2RKF2371X/P2.37KLCT-ND/90181; Stock1: 0; Stock2: 219169
R23 R32 = Res2: Resistor; Manufacturer: Panasonic; PartNumber: ERJ-2RKF2872X; Tolerance: 1%; Descripción: 100mW 50V; CostoVendedor1: 0.021; CostoVendedor2: 0.043; Vendedor1: Mouser; Vendedor2: Digi-Key; Package: 0402; DataSheet: http://www.mouser.com/ds/2/315/AOA0000C86-911473.pdf; LinkVendedor1: https://ar.mouser.com/ProductDetail/Panasonic-Industrial-Devices/ERJ-2RKF2872X?qs=%2fha2pyFadujciewGcSbxYNNJnmJv1Pj7tvIKpS%252bv7nEB8ACddthzew%3d%3d; LinkVendedor2: https://www.digikey.com/product-detail/en/panasonic-electronic-components/ERJ-2RKF2872X/P28.7KLCT-ND/194310; Stock1: 17200; Stock2: 166000
R24 = Res2: Resistor; Manufacturer: Panasonic; PartNumber: ERJ-2RKF1691X; Tolerance: 1%; Descripción: SMD 0402 2.32Kohms 1% AEC-Q200; CostoVendedor1: 0.021; CostoVendedor2: 0.1; Vendedor1: Mouser; Vendedor2: Digi-Key; Package: 0402; DataSheet: https://ar.mouser.com/datasheet/2/315/AOA0000C304-1149620.pdf; LinkVendedor1: https://ar.mouser.com/ProductDetail/Panasonic-Industrial-Devices/ERJ-2RKF1691X?qs=sGAEpiMZZMu61qfTUdNhG6gKAQVNBKOokF%252bWtWjqExM%3d; LinkVendedor2: https://www.digikey.com/product-detail/en/panasonic-electronic-components/ERJ-2RKF1691X/P1.69KLCT-ND/194110; Stock1: 134000; Stock2: 225000
R25 = Res2: Resistor; Manufacturer: Panasonic; PartNumber: ERJ-2RKF4703X; Descripción: Resistores de película gruesa - SMD 0402 470Kohms 1% Anti-Sulfur; CostoVendedor1: 0.021; CostoVendedor2: 0.043; Vendedor1: Mouser; Vendedor2: Digi-Key; Package: 0402; Tolerance: 1%; DataSheet: https://ar.mouser.com/datasheet/2/315/AOA0000C304-1149620.pdf; LinkVendedor1: https://ar.mouser.com/ProductDetail/Panasonic-Industrial-Devices/ERJ-2RKF4703X?qs=sGAEpiMZZMu61qfTUdNhG6gKAQVNBKOoOBZSn%2f3bo7o%3d; LinkVendedor2: https://www.digikey.com/product-detail/en/panasonic-electronic-components/ERJ-2RKF4703X/P470KLCT-ND/1746694; Stock1: 51000; Stock2: 1000000
R26 = Res2: Resistor; Manufacturer: Panasonic; PartNumber: ERJ-2RKF6812X; Tolerance: 1%; Descripción: SMD 0402 39.2Kohms 1% AEC-Q200; CostoVendedor1: 0.021; CostoVendedor2: 0.1; Vendedor1: Mouser; Vendedor2: Digi-Key; Package: 0402; DataSheet: http://www.mouser.com/ds/2/315/AOA0000C86-911473.pdf; LinkVendedor1: https://ar.mouser.com/ProductDetail/Panasonic-Industrial-Devices/ERJ-2RKF6812X?qs=sGAEpiMZZMu61qfTUdNhG6gKAQVNBKOoy7oCebj4IKY%3d; LinkVendedor2: https://www.digikey.com/product-detail/en/panasonic-electronic-components/ERJ-2RKF6812X/P68.1KLCT-ND/194493; Stock1: 40000; Stock2: 400000
R27 = Res2: Resistor; Manufacturer: Panasonic; PartNumber: ERJ-2RKF4122X; Tolerance: 1%; Descripción: SMD Anti-Sulfur  100 mW 50V; CostoVendedor1: 0.021; CostoVendedor2: 0.043; Vendedor1: Mouser; Vendedor2: Digi-Key; Package: 0402; DataSheet: http://www.mouser.com/ds/2/315/AOA0000C104-947597.pdf; LinkVendedor1: https://ar.mouser.com/ProductDetail/Panasonic-Industrial-Devices/ERJ-2RKF4122X?qs=%2fha2pyFadujciewGcSbxYEpSTBVjH3cgNKAtvAaAEx9O5UotSgsaZQ%3d%3d; LinkVendedor2: https://www.digikey.com/product-detail/en/panasonic-electronic-components/ERJ-2RKF4122X/P41.2KLCT-ND/194395; Stock1: 14000; Stock2: 120000
R28 = Res2: Resistor; Manufacturer: Panasonic; PartNumber: ERJ-2RKF1332X; Tolerance: 1%; Descripción: Anti-Sulfur  100 mW 50V; CostoVendedor1: 0.021; CostoVendedor2: 0.043; Vendedor1: Mouser; Vendedor2: Digi-Key; Package: 0402; DataSheet: http://www.mouser.com/ds/2/315/AOA0000C104-947597.pdf; LinkVendedor1: https://ar.mouser.com/ProductDetail/Panasonic-Industrial-Devices/ERJ-2RKF1332X?qs=%2fha2pyFadujciewGcSbxYHk3Rqd18roIeMkrrVX56KjXJKkx%2fxkBNw%3d%3d; LinkVendedor2: https://www.digikey.com/product-detail/en/panasonic-electronic-components/ERJ-2RKF1332X/P13.3KLCT-ND/194165; Stock1: 41500; Stock2: 400000
R29 = Res2: Resistor; Manufacturer: Panasonic; PartNumber: ERJ-2RKF6800X; Tolerance: 1%; Descripción: 100mW 50V; CostoVendedor1: 0.021; CostoVendedor2: 0.1; Vendedor1: Mouser; Vendedor2: Digi-Key; Package: 0402; DataSheet: http://www.mouser.com/ds/2/315/AOA0000C86-911473.pdf; LinkVendedor1: https://ar.mouser.com/ProductDetail/Panasonic-Industrial-Devices/ERJ-2RKF6800X?qs=%2fha2pyFadujciewGcSbxYF3n%252bI2OH73wLEUvQipY8%2fEo46hAJHkmyQ%3d%3d; LinkVendedor2: https://www.digikey.com/product-detail/en/panasonic-electronic-components/ERJ-2RKF6800X/P680LCT-ND/1746711; Stock1: 90000; Stock2: 500000
R30 R33 = Res2: Resistor; Manufacturer: Panasonic; PartNumber: ERJ-U140R00U; Tolerance: 5%; Descripción: 0 Ohms Jumper 0.1W, 1/10W Chip Resistor 0402 (1005 Metric) Automotive AEC-Q200 Thick Film; CostoVendedor1: 0.1; CostoVendedor2: 0.015; Vendedor1: Mouser; Vendedor2: Digi-Key; Package: 0402; DataSheet: http://industrial.panasonic.com/www-cgi/jvcr13pz.cgi?E+PZ+3+AOA0005+ERJS06J821V+7+WW; LinkVendedor1: https://ar.mouser.com/ProductDetail/Panasonic/ERJ-2GE0R00X?qs=%2fha2pyFaduglXGhQbS9dEt88caD0st1lSNveR4fVtSxVbZQ9fL%252b69Q%3d%3d; LinkVendedor2: https://www.digikey.com/product-detail/en/panasonic-electronic-components/ERJ-2GE0R00X/P0.0JCT-ND/146726; Stock1: 30000000; Stock2: 2100000
R31 = Res2: Resistor; Manufacturer: Panasonic; PartNumber: ERJ-2RKF1962X; Tolerance: 1%; Descripción: Anti-Sulfur  100 mW 50V; CostoVendedor1: 0.021; CostoVendedor2: 0.043; Vendedor1: Mouser; Vendedor2: Digi-Key; Package: 0402; DataSheet: http://www.mouser.com/ds/2/315/AOA0000C104-947597.pdf; LinkVendedor1: https://ar.mouser.com/ProductDetail/Panasonic-Industrial-Devices/ERJ-2RKF1962X?qs=%2fha2pyFadujciewGcSbxYHIbNQ46emaWAOmP%252btH69tdqhNpIKww5kg%3d%3d; LinkVendedor2: https://www.digikey.com/product-detail/en/panasonic-electronic-components/ERJ-2RKF1962X/P19.6KLCT-ND/194228; Stock1: 20000; Stock2: 180000
R34 = Res2: Resistor; Manufacturer: Panasonic; PartNumber: ERJ-2RKF2403X; Tolerance: 1%; Descripción: Resistores de película gruesa - SMD 0402 240Kohms 1%; CostoVendedor1: 0.021; CostoVendedor2: 0.043; Vendedor1: Mouser; Vendedor2: Digi-Key; Package: 0402; DataSheet: http://www.mouser.com/ds/2/315/AOA0000C86-911473.pdf; LinkVendedor1: https://ar.mouser.com/ProductDetail/Panasonic-Industrial-Devices/ERJ-2RKF2403X?qs=%2fha2pyFadujciewGcSbxYMiuZpAtud1ZZXHGLBT0ygm0IBwqPn5%252bKg%3d%3d; LinkVendedor2: https://www.digikey.com/product-detail/en/panasonic-electronic-components/ERJ-2RKF2403X/P240KLCT-ND/1746659; Stock1: 120000; Stock2: 500000
R35 R42 = Res2: Resistor; Manufacturer: Panasonic; PartNumber: ERJ-2RKF1602X; Tolerance: 1%; Descripción: 100mW 50V; CostoVendedor1: 0.021; Vendedor1: Mouser; Vendedor2: Digi-Key; Package: 0402; DataSheet: http://www.mouser.com/ds/2/315/AOA0000C86-911473.pdf; LinkVendedor1: https://ar.mouser.com/ProductDetail/Panasonic-Industrial-Devices/ERJ-2RKF1602X?qs=%2fha2pyFadujciewGcSbxYDA5DNwWIVANeOJS5dcwo05oR56mc%252bK2OQ%3d%3d; Stock1: 44000
R36 R41 R43 = Res2: Resistor; Manufacturer: Panasonic; PartNumber: ERJ-2RKF1002X; Tolerance: 1%; Descripción: 100mW 50V; CostoVendedor1: 0.021; Vendedor1: Mouser; Vendedor2: Digi-Key; Package: 0402; DataSheet: http://www.mouser.com/ds/2/315/AOA0000C86-911473.pdf; LinkVendedor1: https://ar.mouser.com/ProductDetail/Panasonic-Industrial-Devices/ERJ-2RKF1002X?qs=%2fha2pyFadujciewGcSbxYCeocmJ1V0ffuiBNpRUU2nm5e2XaRJ685Q%3d%3d; Stock1: 2000000
R37 = Res2: Resistor; Manufacturer: Panasonic; PartNumber: ERJ-2RKF4300X; Tolerance: 1%; Descripción: Resistores de película gruesa - SMD 0402 430ohms 1%; CostoVendedor1: 0.021; CostoVendedor2: 0.043; Vendedor1: Mouser; Vendedor2: Digi-Key; Package: 0402; DataSheet: http://www.mouser.com/ds/2/315/AOA0000C86-911473.pdf; LinkVendedor1: https://ar.mouser.com/ProductDetail/Panasonic-Industrial-Devices/ERJ-2RKF4300X?qs=%2fha2pyFadujciewGcSbxYGHlub5SVobjLDdG%252brv7xkaKfCG4AgwEnw%3d%3d; LinkVendedor2: https://www.digikey.com/product-detail/en/panasonic-electronic-components/ERJ-2RKF4300X/P430LCT-ND/1746686; Stock1: 36000; Stock2: 1500000
R38 R114 R115 = Res2: Resistor; Manufacturer: Panasonic; PartNumber: ERJ-2RKF10R0X; Descripción: SMD 0402 1% 10ohm Anti-Surge AEC-Q200; CostoVendedor1: 0.021; Vendedor1: Mouser; Vendedor2: Digi-Key; Package: 0402; Tolerance: 1%; DataSheet: http://www.mouser.com/ds/2/315/AOA0000C291-1101061.pdf; LinkVendedor1: https://ar.mouser.com/ProductDetail/Panasonic-Industrial-Devices/ERJ-2RKF10R0X?qs=sGAEpiMZZMu61qfTUdNhGzRxdwze5h8Zlk5qBe8JEKw%3d; Stock1: 400000
R39 = Res2: Resistor; Manufacturer: Panasonic; PartNumber: ERJ-2RKF3012X; Tolerance: 1%; Descripción: Resistores de película gruesa - SMD 0402 30.1Kohms 1%; CostoVendedor1: 0.021; CostoVendedor2: 0.043; Vendedor1: Mouser; Vendedor2: Digi-Key; Package: 0402; DataSheet: http://www.mouser.com/ds/2/315/AOA0000C86-911473.pdf; LinkVendedor1: https://ar.mouser.com/ProductDetail/Panasonic-Industrial-Devices/ERJ-2RKF3012X?qs=%2fha2pyFadujciewGcSbxYGnwcuOwwPxjmd0YAzwCGZ1AtEB31isCtw%3d%3d; LinkVendedor2: https://www.digikey.com/product-detail/en/panasonic-electronic-components/ERJ-2RKF3012X/P30.1KLCT-ND/194332; Stock1: 49000; Stock2: 500000
R40 = Res2: Resistor; Manufacturer: Panasonic; PartNumber: ERJ-2RKF2002X; Tolerance: 1%; Descripción: 100mW 50V; CostoVendedor1: 0.021; Vendedor1: Mouser; Vendedor2: Digi-Key; Package: 0402; DataSheet: http://www.mouser.com/ds/2/315/AOA0000C283-1093288.pdf; LinkVendedor1: https://ar.mouser.com/ProductDetail/Panasonic-Industrial-Devices/ERJ-2RKF2002X?qs=%2fha2pyFadujciewGcSbxYM%252bE4%252brkFV4w8ap%252bxu3zFF6NLHBpv5LbVA%3d%3d; Stock1: 300000
U4 = ADP5054ACPZ-R7: Quad Buck Regulator; Manufacturer: Analog Devices; Descripción: Reguladores de voltaje,SMD,48pins; CostoVendedor1: 9.88; CostoVendedor2: 10.76; Vendedor1: Mouser; Vendedor2: Digi-Key; Value: Value; Package: LFCSP-48; PartNumber: ADP5054ACPZ-R7; DataSheet: http://www.mouser.com/ds/2/609/ADP5054-539876.pdf; LinkVendedor1: https://ar.mouser.com/ProductDetail/Analog-Devices/ADP5054ACPZ-R7?qs=sGAEpiMZZMsgNhPy3wz0s6vYGm9pCoBEqWL8SjhLYQw%3d; LinkVendedor2: https://www.digikey.com/product-detail/en/analog-devices-inc/ADP5054ACPZ-R7/ADP5054ACPZ-R7CT-ND/6568640; Stock1: 1200 en pedido 5 de junio; Stock2: 0 en pedido
U5 = LTC4412ES6#PBF: Power Path Selector; Manufacturer: Analog Devices; PartNumber: LTC4412ES6#TRMPBF; Descripción: Gestión de energía especializada - circuitos integrados de gestión de potencia (PMIC) Automatic PowerPath Controller in ThinSOT; CostoVendedor1: 3.25; Vendedor1: Mouser; Vendedor2: Digi-Key; Value: Value; DataSheet: https://ar.mouser.com/datasheet/2/609/4412fb-1268394.pdf; LinkVendedor1: https://ar.mouser.com/ProductDetail/Analog-Devices/LTC4412ES6TRMPBF?qs=sGAEpiMZZMvi6wO7nhr1Lzmxu3AecYhW9QhHJhp0CGA%3d; Stock1: 2700
U6 U9 = ADP1755ACPZ-R7: Power Regulator; Manufacturer: Analog Devices; Descripción: Reguladores de tensión lineal IC 12A LDO Adj Vout; CostoVendedor1: 2.73; CostoVendedor2: 2.67; Vendedor1: Mouser; Vendedor2: Digi-Key; Value: Value; DataSheet: https://ar.mouser.com/datasheet/2/609/ADP1754_1755-878861.pdf; Package: LFCSP-16; PartNumber: ADP1755ACPZ-R7; LinkVendedor1: https://ar.mouser.com/ProductDetail/Analog-Devices/ADP1755ACPZ-R7?qs=%2fha2pyFaduj0rYTiYwi%252bvltrClumPOBTNNGFW99baabIe0APzbjmKw%3d%3d; LinkVendedor2: https://www.digikey.com/product-detail/en/analog-devices-inc/ADP1755ACPZ-R7/ADP1755ACPZ-R7CT-ND/2467556; Stock1: 8000; Stock2: 3000
U7 = TPS76801QDR: Power Regulator; Manufacturer: Texas Instruments; Descripción: Reguladores de tensión LDO Micropower LDO Reg; CostoVendedor1: 2.78; CostoVendedor2: 2.87; Vendedor1: Mouser; Vendedor2: Digi-Key; DataSheet: http://www.ti.com/lit/ds/symlink/tps768.pdf; Package: 8-SOIC; PartNumber: TPS76801QDR; LinkVendedor1: https://ar.mouser.com/ProductDetail/Texas-Instruments/TPS76801QDR?qs=sGAEpiMZZMsGz1a6aV8DcPXeWoVS0Fnz%252bcHJMWzMTmI%3d; LinkVendedor2: https://www.digikey.com/product-detail/en/texas-instruments/TPS76801QDR/296-39494-1-ND/5143442; Stock1: 3900; Stock2: 7000
U8 = ADP2164ACPZ-R7: Power Regulator; Manufacturer: Analog Devices; Descripción: Reguladores de voltaje de conmutación 6.5V 4A Hi Eff Step-Down; CostoVendedor1: 4.19; CostoVendedor2: 4.53; Vendedor1: Mouser; Vendedor2: Digi-Key; DataSheet: https://ar.mouser.com/datasheet/2/609/ADP2164-878845.pdf; Package: 16-WQFN Exposed Pad, CSP; PartNumber: ADP2164ACPZ-R7; LinkVendedor1: https://ar.mouser.com/ProductDetail/Analog-Devices/ADP2164ACPZ-R7?qs=%2fha2pyFadujf48tNAsVG7wmwYCabbHnn9WbWUM3XUTfgJtIhvRpoNA%3d%3d; LinkVendedor2: https://www.digikey.com/product-detail/en/analog-devices-inc/ADP2164ACPZ-R7/ADP2164ACPZ-R7CT-ND/3071271; Stock1: 1700; Stock2: 1800